# EAGLE design schema_sensori_di_linea (EAGLE 9.6.2)
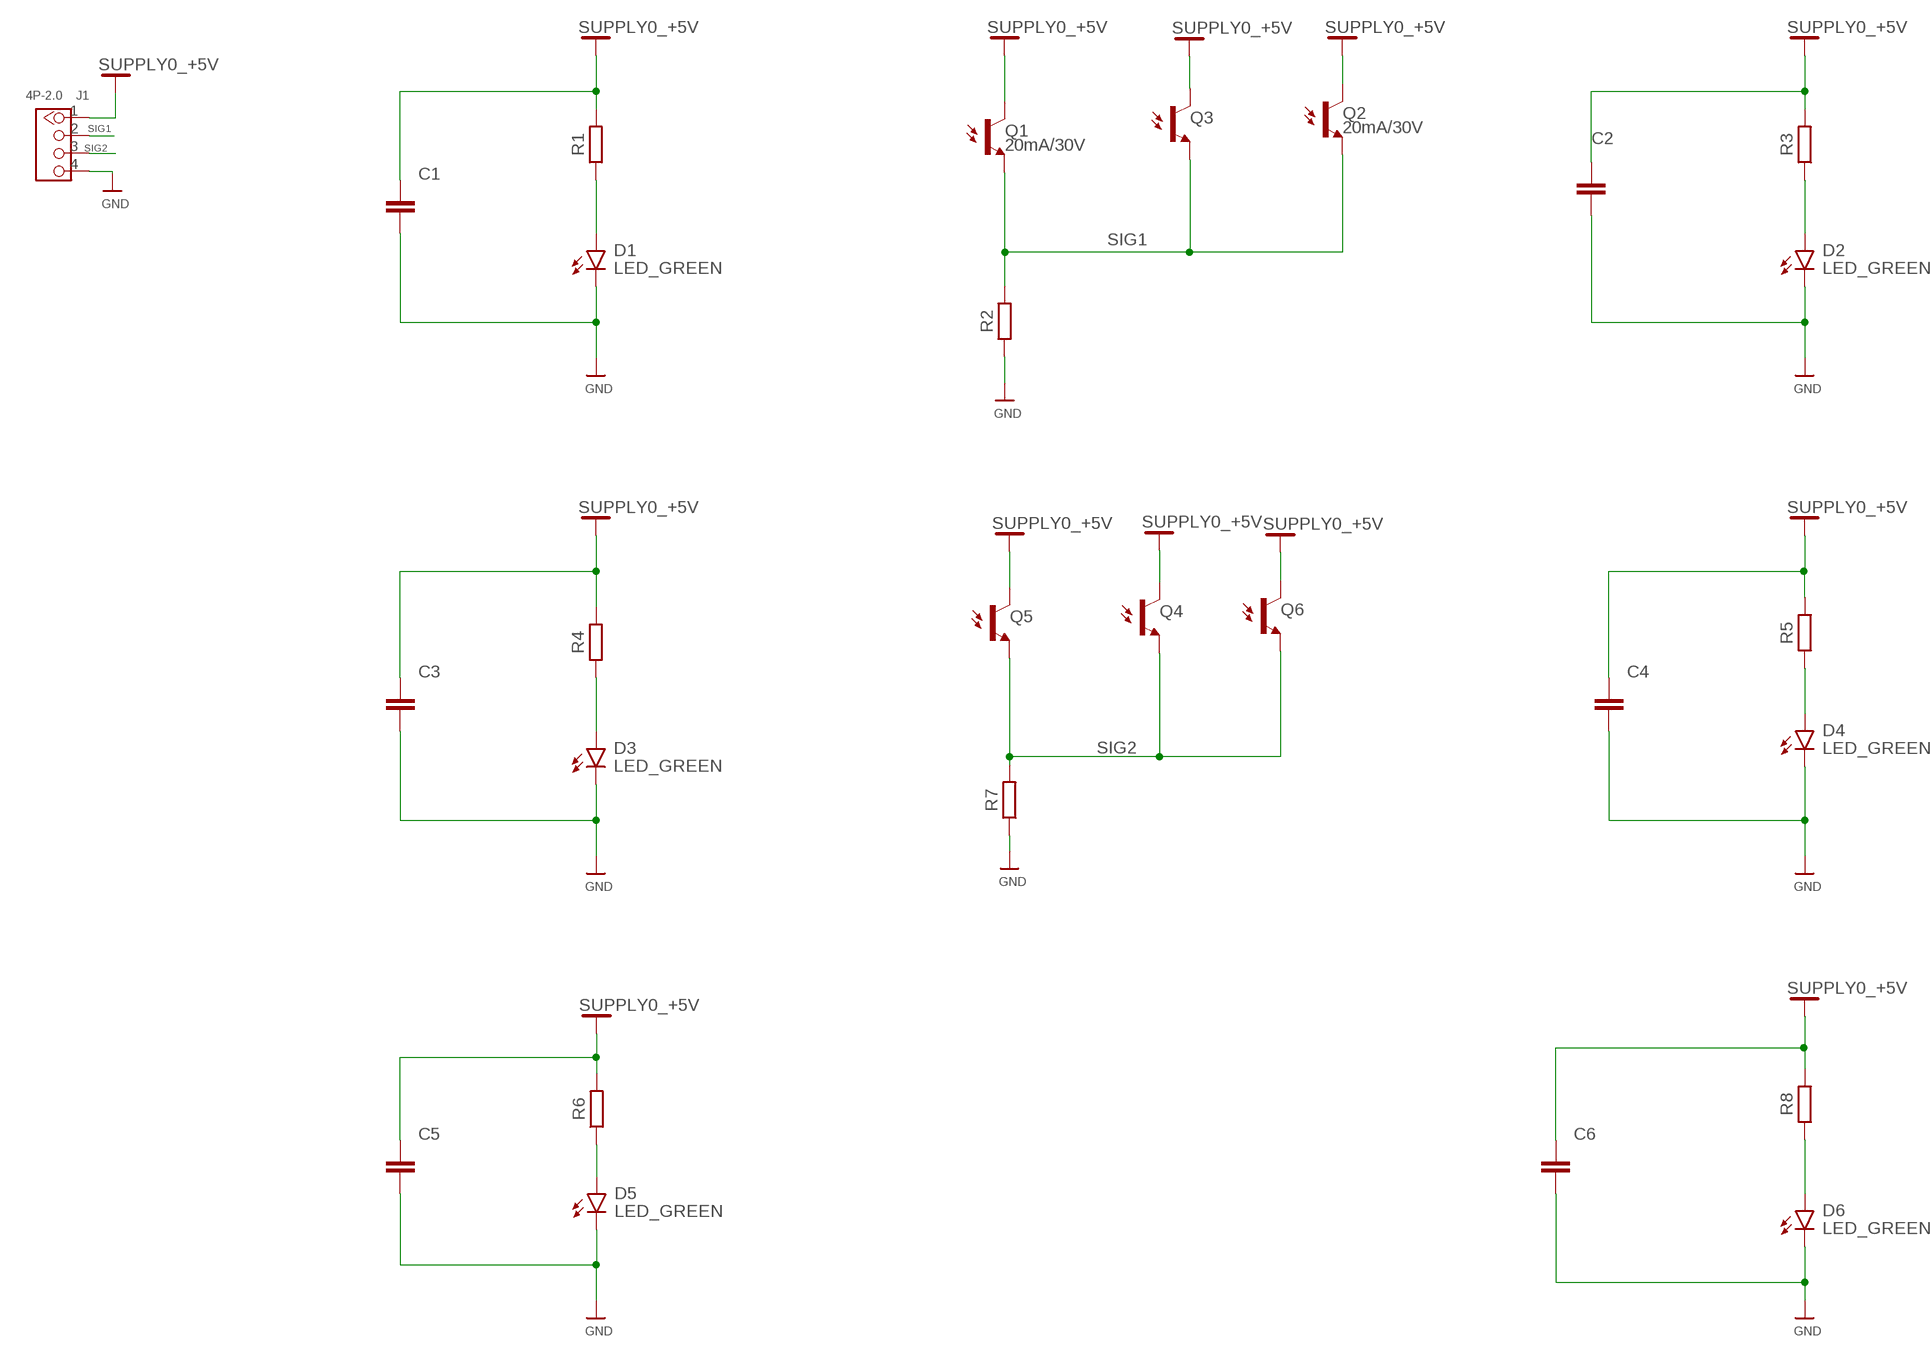
[diagram p0: schematic, sheet 1]

## Parts
C1  100nf  C_CHIP-0805(2012-METRIC)  [CAPC2012X110]
C2  C_CHIP-0805(2012-METRIC)  [CAPC2012X110]
C3  C_CHIP-0805(2012-METRIC)  [CAPC2012X110]
C4  C_CHIP-0805(2012-METRIC)  [CAPC2012X110]
C5  C_CHIP-0805(2012-METRIC)  [CAPC2012X110]
C6  C_CHIP-0805(2012-METRIC)  [CAPC2012X110]
D1  LED_GREEN  CHIP-FLAT-G_0805  [LEDC2012X110N_FLAT-G]
D2  LED_GREEN  CHIP-FLAT-G_0805  [LEDC2012X110N_FLAT-G]
D3  LED_GREEN  CHIP-FLAT-G_0805  [LEDC2012X110N_FLAT-G]
D4  LED_GREEN  CHIP-FLAT-G_0805  [LEDC2012X110N_FLAT-G]
D5  LED_GREEN  CHIP-FLAT-G_0805  [LEDC2012X110N_FLAT-G]
D6  LED_GREEN  CHIP-FLAT-G_0805  [LEDC2012X110N_FLAT-G]
J1  4P-2.0  GROVE-CONNECTOR-DIP(4P-2.0)  [HW4-2.0]
Q1  20mA/30V  PHOTOTRANSISTORPT17-21C-L41-TR8  [PT17-21C-L41-TR8]
Q2  20mA/30V  PHOTOTRANSISTORPT17-21C-L41-TR8  [PT17-21C-L41-TR8]
Q3  20mA/30V  PHOTOTRANSISTORPT17-21C-L41-TR8  [PT17-21C-L41-TR8]
Q4  20mA/30V  PHOTOTRANSISTORPT17-21C-L41-TR8  [PT17-21C-L41-TR8]
Q5  20mA/30V  PHOTOTRANSISTORPT17-21C-L41-TR8  [PT17-21C-L41-TR8]
Q6  20mA/30V  PHOTOTRANSISTORPT17-21C-L41-TR8  [PT17-21C-L41-TR8]
R1  330  R_CHIP-0805(2012-METRIC)  [RESC2012X65]
R2  R_CHIP-0805(2012-METRIC)  [RESC2012X65]
R3  R_CHIP-0805(2012-METRIC)  [RESC2012X65]
R4  R_CHIP-0805(2012-METRIC)  [RESC2012X65]
R5  R_CHIP-0805(2012-METRIC)  [RESC2012X65]
R6  R_CHIP-0805(2012-METRIC)  [RESC2012X65]
R7  R_CHIP-0805(2012-METRIC)  [RESC2012X65]
R8  R_CHIP-0805(2012-METRIC)  [RESC2012X65]

## Nets
+5V: C1.1 C2.1 C3.1 C4.1 C5.1 C6.1 J1.1 Q1.C Q2.C Q3.C Q4.C Q5.C Q6.C R1.2 R3.2 R4.2 R5.2 R6.2 R8.2 ; supply symbol labelled SUPPLY0_+5V
GND: C1.2 C2.2 C3.2 C4.2 C5.2 C6.2 D1.C D2.C D3.C D4.C D5.C D6.C J1.4 R2.1 R7.1
N$3: D1.A R1.1
N$5: D2.A R3.1
N$6: D3.A R4.1
N$8: D4.A R5.1
N$10: D5.A R6.1
N$12: D6.A R8.1
SIG1: J1.2 Q1.E Q2.E Q3.E R2.2
SIG2: J1.3 Q4.E Q5.E Q6.E R7.2

## Library data of the parts
C1-C6 = Capacitor:C: Capacitor - Generic; CATEGORY: Capacitor
D1-D6 = LED:CHIP-FLAT-G; CATEGORY: LED; COLOR: GREEN; DESCRIPTION: CHIP LED FLAT; SUB-CATEGORY: CHIP; TYPE: FLAT_TOP
J1 = OPL_Connector:GROVE-CONNECTOR-DIP(4P-2.0): 320110033
Q1-Q6 = SparkFun-DiscreteSemi:PHOTOTRANSISTOR: Phototransistor PT17-21C/L41/TR8 is a phototransistor in miniature SMD package which is molded in a water clear with flat top view lens. The device is Spectrally matched to visible and infrared emitting diode. Datasheet <http://www.everlight.com/file/ProductFile/PT17-21C-L41-TR8.pdf> SparkFun Products: SparkFun Electric Imp imp002 Breakout <https://www.sparkfun.com/products/12958>; PROD_ID: TRANS-12141
R1-R8 = Resistor:R: Resistor Fixed - Generic; CATEGORY: Resistor; SUB-CATEGORY: Fixed

## Board
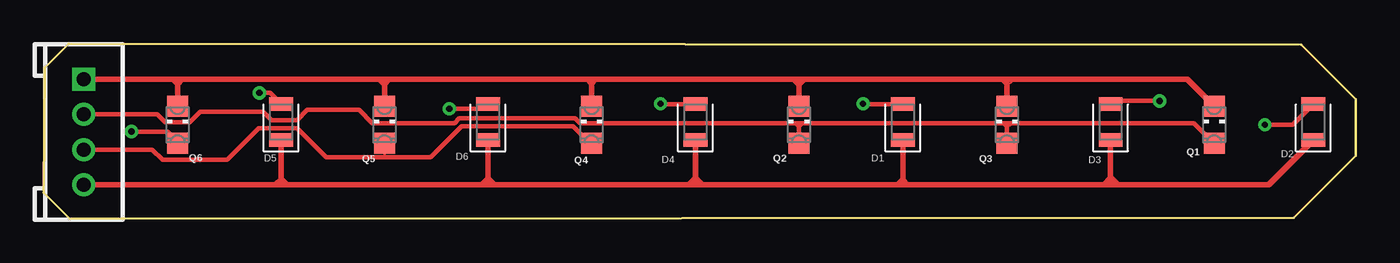
[diagram p1: board, top side]
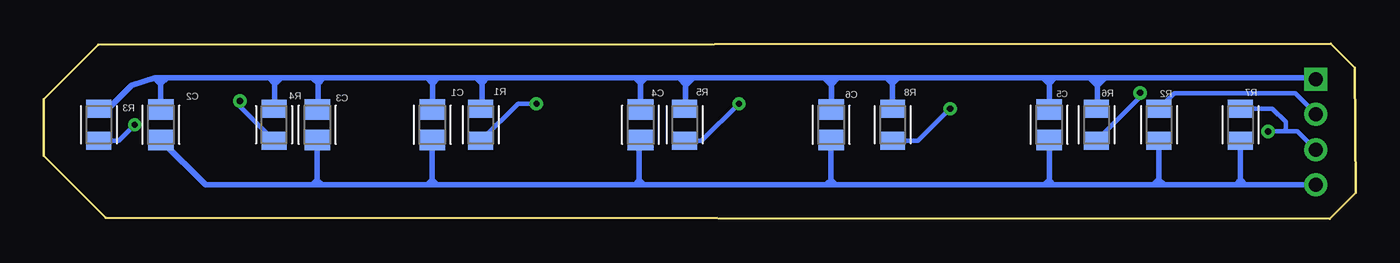
[diagram p2: board, bottom side, seen from below]

Size 74.71 x 9.96 mm. Coordinates in mm from the lower left corner, seen from the top.
Outline: 71.62,9.91 1.41,9.96 0.04,8.6 0,1.49 1.48,0 71.19,0.08 74.71,3.59 74.71,6.82 71.62,9.91
Copper layers (1*16): Top 0.035mm / dielectric 1.5mm / Bottom 0.035mm
Design rules "default": minimum track width 6mil, minimum drill 0.35mm, track to track 6mil, track to pad 6mil, pad to pad 6mil, via to via 6mil, smd to smd 6mil, copper to edge 40mil, drill to drill 6mil, minimum pad ring 10mil, minimum via ring 8mil, stop-mask expansion 4mil, vias tented up to drill 0mil, thermal gap 10mil

### Footprints (pad centres in the part's own frame; a part is rotated, then mirrored left to right if it is on the bottom)
CAPC2012X110 = smd 1.165 x 1.465: 1 -0.875,0; 2 0.875,0
LEDC2012X110N_FLAT-G = smd 0.762 x 1.362: A 1.025,0; C -1.025,0
HW4-2.0 = drill 0.8 pad 1.27 square: 1 -3,0 | drill 0.8 pad 1.27: 2 -1,0; 3 1,0; 4 3,0
PT17-21C-L41-TR8 = smd 1.2 x 1.2: C 0,1.05; E 0,-1.05
RESC2012X65 = smd 1.031 x 1.42: 1 -0.919,0; 2 0.919,0

### Placement (x,y rotation side)
C1  52.59,5.36 270 bottom
C2  68.05,5.36 270 bottom
C3  59.14,5.36 270 bottom
C4  40.73,5.36 270 bottom
C5  17.45,5.36 270 bottom
C6  29.87,5.36 270 bottom
D1  48.92,5.51 90 top
D2  72.3,5.51 90 top
D3  60.76,5.51 90 top
D4  37.1,5.51 90 top
D5  13.51,5.51 90 top
D6  25.3,5.51 90 top
J1  2.28,4.95 270 top
Q1  66.65,5.36 0 top
Q2  43.01,5.36 0 top
Q3  54.85,5.36 0 top
Q4  31.2,5.36 0 top
Q5  19.4,5.36 0 top
Q6  7.62,5.36 0 top
R1  49.83,5.36 90 bottom
R2  11.2,5.36 90 bottom
R3  71.59,5.36 90 bottom
R4  61.61,5.36 90 bottom
R5  38.22,5.36 90 bottom
R6  14.76,5.36 90 bottom
R7  6.56,5.36 90 bottom
R8  26.37,5.36 90 bottom

### Tracks (layer width: path | path; a pad name or v marks a point on that pad's centre or on a via)
+5V
  Top 0.152: 7.57,7.95 7.62,7.9 7.62,7.68 | 19.4,7.89 19.45,7.95 | 19.4,7.61 19.4,7.67 | 19.67,7.95 19.69,7.95 | 31.19,7.71 31.19,7.93 31.18,7.95 | 30.96,7.95 30.86,7.95 | 31.4,7.91 31.4,7.95 | 43.05,7.95 43.01,7.9 43.01,7.67 | 42.73,7.95 | 54.82,7.95 54.85,7.91 | 54.44,7.95 54.45,7.95 54.85,7.54 55.21,7.9 55.21,7.95
  Top 0.3: J1.1 7.35,7.95 | 7.35,7.95 7.57,7.95 7.89,7.95 | 7.89,7.95 19.12,7.95 | 19.12,7.95 19.45,7.95 19.69,7.95 30.86,7.95 31.18,7.95 31.4,7.95 42.73,7.95 43.05,7.95 43.28,7.95 | 43.28,7.95 54.44,7.95 54.82,7.95 55.21,7.95 65.12,7.95 Q1.C | Q6.C 7.62,7.68 7.89,7.95 | Q5.C 19.4,7.61 19.4,7.89 | 7.62,7.68 7.35,7.95 | 19.12,7.95 19.4,7.67 19.67,7.95 | 31.19,7.71 Q4.C | 31.19,7.71 30.96,7.95 | 31.19,7.71 31.4,7.91 | Q2.C 43.01,7.67 42.73,7.95 | 43.01,7.67 43.28,7.95 | Q3.C 54.85,7.54 54.85,7.91
  Bottom 0.152: 2.36,8.03 J1.1 | 14.71,6.32 R6.2 | 14.29,8.03 14.29,8.02 | 17.45,7.7 17.45,8.03 | 17.78,8.03 17.79,8.03 | 26.37,7.73 26.37,8 26.39,8.03 | 29.87,8.03 | 26.65,8.01 26.65,8.03 | 29.48,8.03 29.35,8.03 | 30.26,8.03 30.32,8.03 | R5.2 38.16,6.34 | 37.79,7.97 37.79,8.03 | 38.16,7.64 38.16,7.6 | 40.73,7.76 40.73,8.02 40.72,8.03 | 40.46,8.03 40.44,8.03 | 40.98,8.01 40.98,8.03 | R1.2 49.77,6.34 | 49.77,8.03 49.77,7.73 | C1.1 52.58,6.25 | 52.58,8.03 52.58,7.71 | 49.47,8.03 49.45,8.03 | 50.06,8.03 50.2,8.03 | 52.29,7.99 52.29,8.03 | C3.1 59.1,6.27 | 59.1,8.03 59.1,7.71 59.1,7.7 | R4.2 61.56,6.32 | 58.78,8.03 58.71,8.03 | 61.23,8.02 61.23,8.03 | 61.56,7.69 61.56,7.71 | 68.05,7.68 68.05,8 68.08,8.03 | 68.32,7.95 68.32,8.03
  Bottom 0.3: 61.88,8.03 61.56,8.03 | 61.56,8.03 61.23,8.03 59.42,8.03 | 59.42,8.03 59.1,8.03 58.71,8.03 52.9,8.03 | 52.9,8.03 52.58,8.03 52.29,8.03 50.2,8.03 49.77,8.03 49.45,8.03 40.98,8.03 40.72,8.03 40.44,8.03 38.55,8.03 | 38.55,8.03 38.16,8.03 | 38.16,8.03 37.79,8.03 30.32,8.03 29.87,8.03 29.35,8.03 26.65,8.03 26.39,8.03 26.07,8.03 | 26.07,8.03 17.79,8.03 17.45,8.03 17.12,8.03 | 17.12,8.03 15.13,8.03 | 15.13,8.03 14.71,8.03 | 14.71,8.03 14.29,8.03 2.36,8.03 | 14.71,6.32 14.71,7.6 14.29,8.02 | 14.71,8.03 14.71,7.61 15.13,8.03 | C5.1 17.45,7.7 | 17.45,7.7 17.12,8.03 | 17.45,7.7 17.78,8.03 | R8.2 26.37,7.73 | C6.1 29.87,7.64 | 29.87,7.64 29.87,8.03 | 26.07,8.03 26.37,7.73 | 26.37,7.73 26.65,8.01 | 29.87,7.64 29.48,8.03 | 29.87,7.64 30.26,8.03 | 38.16,6.34 38.16,7.6 | 38.16,8.03 38.16,7.6 | 38.16,7.6 37.79,7.97 | 38.55,8.03 38.16,7.64 | C4.1 40.73,7.76 | 40.73,7.76 40.46,8.03 | 40.73,7.76 40.98,8.01 | 49.77,6.34 49.77,7.73 | 52.58,6.25 52.58,7.71 52.29,7.99 | 49.77,7.73 49.47,8.03 | 49.77,7.73 50.06,8.03 | 52.9,8.03 52.58,7.71 | 59.1,6.27 59.1,7.7 58.78,8.03 | 61.56,6.32 61.56,7.69 | 61.56,7.69 61.56,8.03 | 59.42,8.03 59.1,7.71 | 61.56,7.69 61.23,8.02 | 61.56,7.71 61.88,8.03 | R3.2 71.04,6.28 69.7,7.62 68.37,8.03 68.32,8.03 68.08,8.03 67.7,8.03 | 61.88,8.03 67.7,8.03 | C2.1 68.05,7.68 | 67.7,8.03 68.05,7.68 | 68.05,7.68 68.32,7.95
GND
  Top 0.152: 13.51,2.27 13.51,1.95 13.5,1.95 | 13.89,1.95 13.84,1.95 | 13.2,1.96 13.2,1.95 | 25.3,1.95 | 25.69,1.95 25.64,1.95 | 24.98,1.97 24.98,1.95 | 37.1,1.96 37.12,1.95 | 36.74,1.95 | 37.1,2.31 37.11,2.31 | 48.92,2 48.98,1.95 | 48.92,2.22 48.92,2.42 | 48.65,1.95 48.64,1.95 | 60.76,1.96 60.77,1.95 | 60.78,2.34 60.76,2.34 | 60.37,1.96 60.37,1.95
  Top 0.3: J1.4 13.2,1.95 13.5,1.95 13.89,1.95 24.98,1.95 25.3,1.95 25.69,1.95 36.74,1.95 37.12,1.95 37.47,1.95 | 61.18,1.95 69.76,1.95 D2.C | 61.18,1.95 60.77,1.95 60.37,1.95 49.19,1.95 | 49.19,1.95 48.98,1.95 48.64,1.95 37.47,1.95 | 13.51,2.27 D5.C | 13.84,1.95 13.51,2.27 | 13.51,2.27 13.2,1.96 | 25.3,2.29 D6.C | 25.3,1.95 25.3,2.29 | 25.64,1.95 25.3,2.29 | 25.3,2.29 24.98,1.97 | D4.C 37.1,2.43 37.1,2.31 | 37.1,1.96 37.1,2.31 | 37.1,2.31 36.74,1.95 | 37.11,2.31 37.47,1.95 | D1.C 48.92,2.42 48.92,2.22 | 48.92,2.22 48.92,2 | 49.19,1.95 48.92,2.22 | 48.92,2.22 48.65,1.95 | 60.76,2.34 D3.C | 60.76,1.96 60.76,2.34 | 61.18,1.95 60.78,2.34 | 60.76,2.34 60.37,1.96
  Bottom 0.152: 6.56,2 6.51,1.95 | 6.83,1.95 6.92,1.95 | 6.56,2.22 6.55,2.22 | 11.18,1.95 11.2,1.96 11.2,2.23 11.19,2.23 | 11.49,1.95 11.51,1.95 | 17.45,2.2 17.45,1.95 17.46,1.95 | 17.71,1.95 17.74,1.95 | 17.2,1.95 | C6.2 29.88,4.47 | 29.88,1.95 29.88,2.21 | 30.14,1.95 30.14,2.02 30.07,2.02 | C4.2 40.81,4.41 | 40.81,2.19 40.81,1.95 | 41.05,1.95 41.09,1.95 | 52.6,1.95 52.59,1.96 52.59,2.2 52.59,2.24 | 59.14,2.21 59.14,1.97 59.16,1.95 | 58.89,1.96 58.89,1.95
  Bottom 0.3: J1.4 6.28,1.95 | 6.28,1.95 6.51,1.95 6.92,1.95 10.91,1.95 | 10.91,1.95 11.18,1.95 11.51,1.95 17.2,1.95 17.46,1.95 17.74,1.95 29.62,1.95 | 29.62,1.95 29.88,1.95 30.14,1.95 40.57,1.95 | 40.57,1.95 40.81,1.95 41.09,1.95 52.34,1.95 | 59.4,1.95 65.51,1.95 C2.2 | 59.4,1.95 59.16,1.95 58.89,1.95 52.85,1.95 | 52.85,1.95 52.6,1.95 52.34,1.95 | R7.1 6.56,2.22 | 6.56,2 6.56,2.22 | 6.56,2.22 6.83,1.95 | 6.55,2.22 6.28,1.95 | R2.1 11.2,2.23 11.49,1.95 | 11.19,2.23 10.91,1.95 | C5.2 17.45,2.2 | 17.45,2.2 17.71,1.95 | 17.45,2.2 17.2,1.95 | 29.88,4.47 29.88,2.21 | 29.62,1.95 29.88,2.21 | 29.88,2.21 30.07,2.02 | 40.81,4.41 40.81,2.19 | 40.81,2.19 40.57,1.95 | 41.05,1.95 40.81,2.19 | C1.2 52.59,2.24 | 52.85,1.95 52.59,2.2 | 52.59,2.2 52.34,1.95 | C3.2 59.14,2.21 | 59.4,1.95 59.14,2.21 | 59.14,2.21 58.89,1.96
N$3  (via drill 0.35)
  Top 0.152: v46.67,6.54 v46.66,6.55
  Top 0.254: D1.A v46.67,6.54
  Bottom 0.254: R1.1 47.72,6.55 v46.66,6.55
N$5  (via drill 0.35)
  Top 0.254: D2.A 71.12,5.36 v69.54,5.36
  Bottom 0.254: v69.54,5.36 70.46,4.44 R3.1
N$6  (via drill 0.35)
  Top 0.152: 60.93,6.71 D3.A
  Top 0.254: v63.55,6.71 60.93,6.71
  Bottom 0.254: R4.1 63.55,6.38 v63.55,6.71
N$8  (via drill 0.35)
  Top 0.152: v35.12,6.56 35.14,6.54
  Top 0.254: 35.14,6.54 D4.A
  Bottom 0.254: R5.1 37.24,4.44 v35.12,6.56
N$10  (via drill 0.35)
  Top 0.152: v12.28,7.17
  Top 0.254: D5.A 12.88,7.17 v12.28,7.17
  Bottom 0.152: 12.28,6.92 v12.28,7.17
  Bottom 0.254: R6.1 12.28,6.92
N$12  (via drill 0.35)
  Top 0.152: D6.A 24.91,6.54 24.64,6.27
  Top 0.254: 24.64,6.27 v23.1,6.27
  Bottom 0.254: R8.1 24.93,4.44 v23.1,6.27
SIG1
  Top 0.152: 43.01,5.4 43.05,5.45 | 54.85,5.42 54.89,5.45 | 42.6,5.45 42.72,5.45 43.01,5.16 43.27,5.42 43.27,5.45 | 54.56,5.45 54.85,5.16 54.85,5.15 55.13,5.43 55.13,5.45
  Top 0.254: J1.2 6.46,5.95 6.91,5.5 8.32,5.5 8.91,6.09 12.5,6.09 12.97,5.62 14.42,5.62 15.01,6.21 17.94,6.21 18.71,5.44 23.38,5.44 23.66,5.72 30.26,5.72 30.53,5.45 42.6,5.45 43.05,5.45 43.27,5.45 54.56,5.45 54.89,5.45 55.13,5.45 65.51,5.45 Q1.E | Q2.E 43.01,5.16 43.01,5.4 | Q3.E 54.85,5.15 54.85,5.42
  Bottom 0.254: J1.2 2.28,5.99 3.43,7.14 10.33,7.14 R2.2
SIG2  (via drill 0.35)
  Top 0.152: 31.09,4.31 Q4.E | Q5.E 19.4,3.65 | 19.4,3.65 19.4,3.53 19.42,3.51 | 19.4,3.65 19.54,3.51 | 19.4,3.65 | 19.4,3.65 19.26,3.51 | Q6.E 7.62,4.42
  Top 0.254: J1.3 6.17,3.95 6.76,3.35 10.44,3.35 12.24,5.16 14.43,5.16 16.08,3.51 19.26,3.51 19.42,3.51 19.54,3.51 22.03,3.51 23.79,5.27 30.13,5.27 31.09,4.31 | v4.99,4.97 6.95,4.97 7.06,4.97 7.62,4.42
  Bottom 0.152: 4.97,5 v4.99,4.97 | 3.98,5 3.98,5.18 | 3.98,5.18 4.16,5 | 3.79,5 3.98,5.18
  Bottom 0.254: J1.3 3.33,5 3.79,5 3.98,5 4.16,5 4.97,5 | R7.2 4.74,6.28 3.98,5.52 3.98,5.18